# Altium schematic sheet EMS_TC_PWR.SchDoc
size B; SheetNumber: 2; SheetTotal: 2
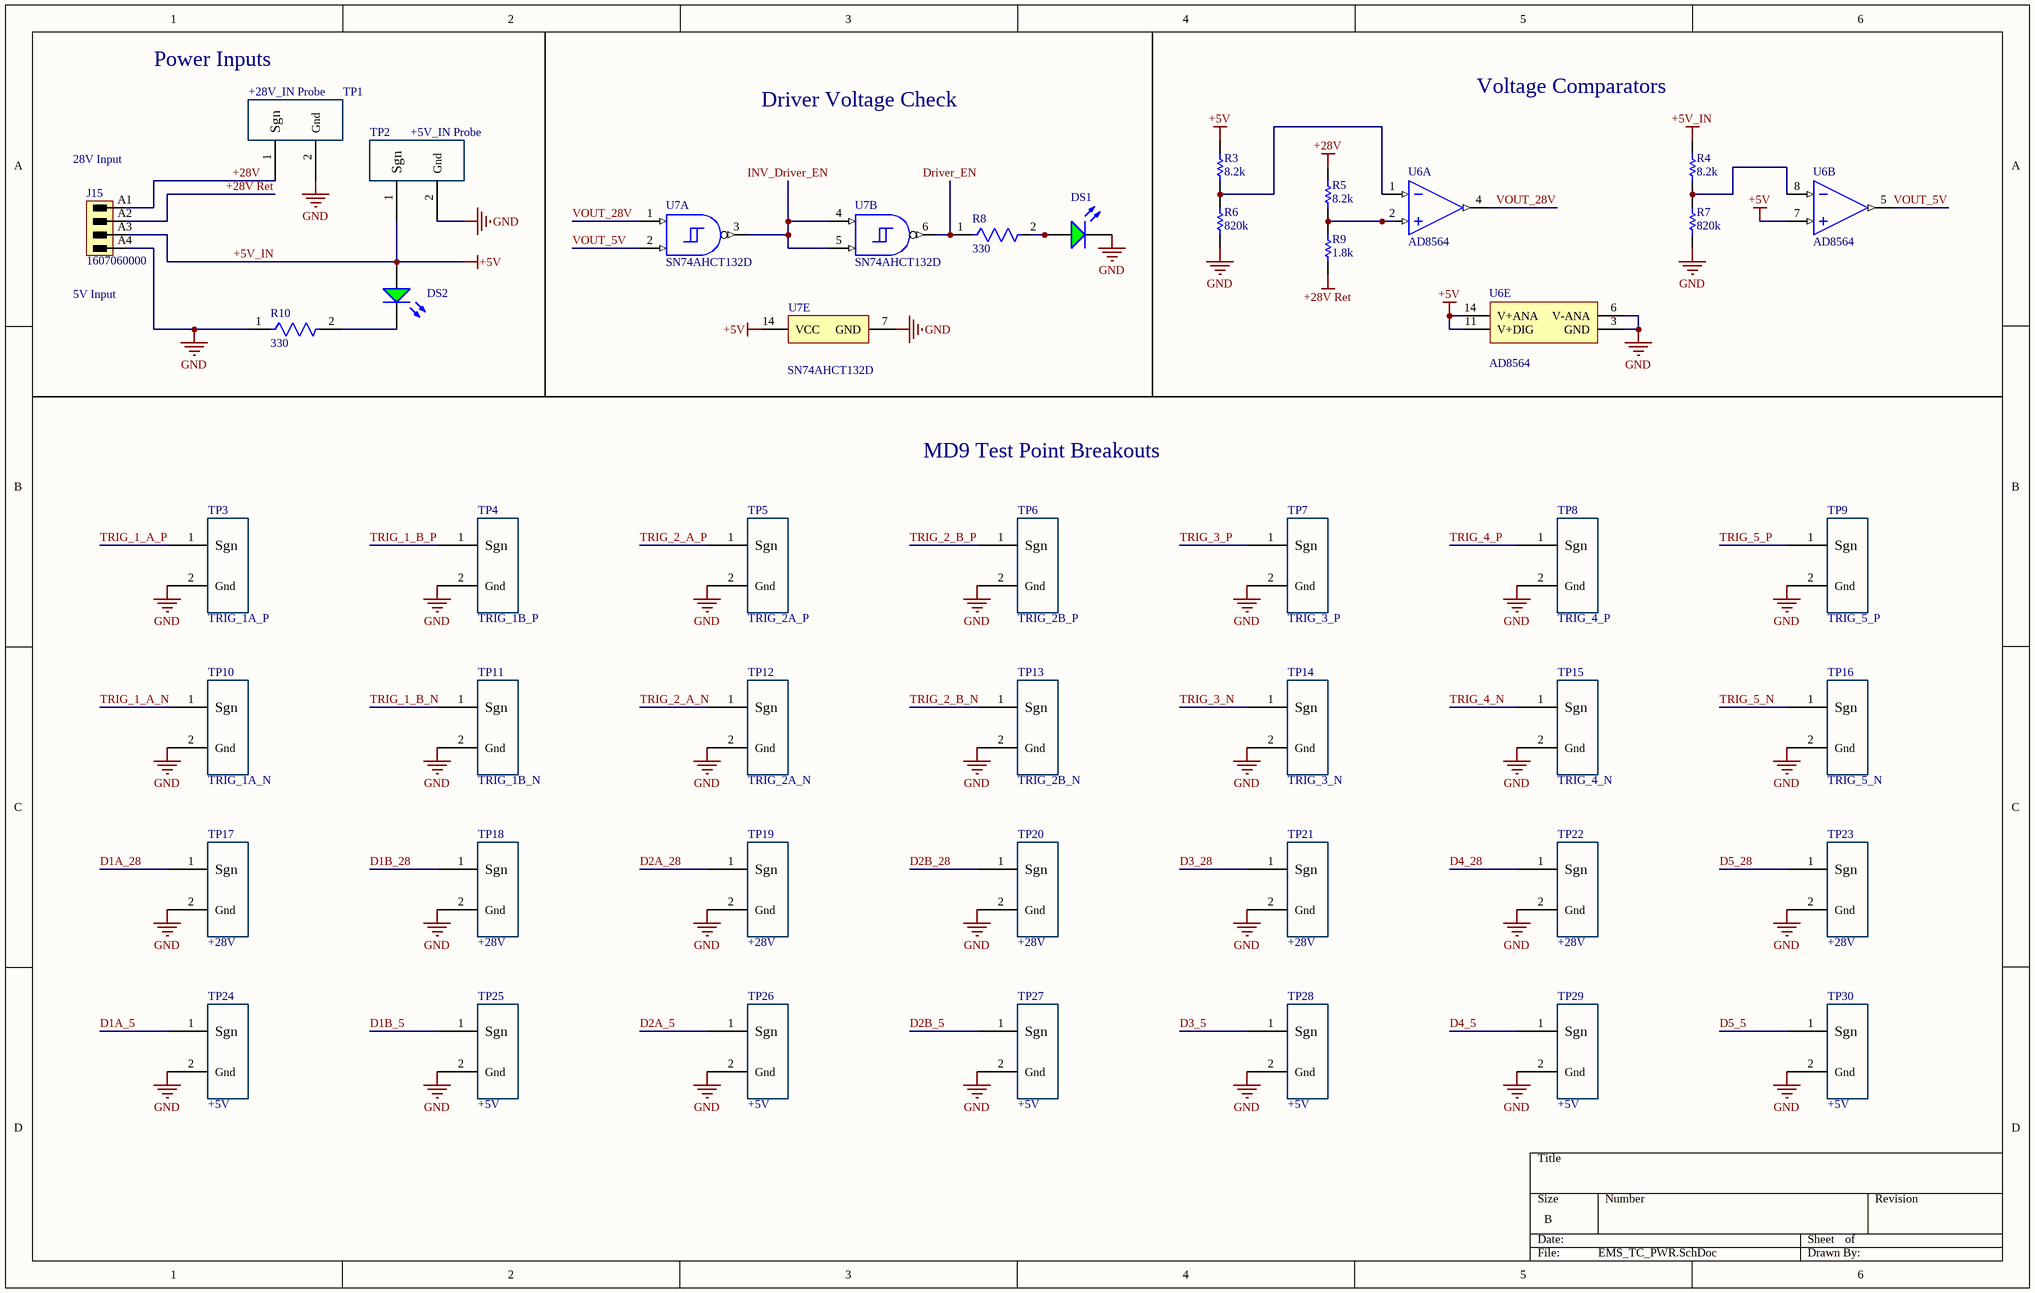
[diagram p0: EMS_TC_PWR.SchDoc]

## Parts
DS1  SML-LX1206GC-TR  [LUMX-SML-LX1206GC-TR_V]  (value not drawn)
DS2  SML-LX1206GC-TR  [LUMX-SML-LX1206GC-TR_V]  (value not drawn)
J15  1607060000  [SL_3_50_90F_04]
R3  8.2k  [RESC3216X70X50LL05T20]
R4  8.2k  [RESC3216X70X50LL05T20]
R5  8.2k  [RESC3216X70X50LL05T20]
R6  820k  [RESC3216X70X50LL20T25]
R7  820k  [RESC3216X70X50LL20T25]
R8  330  [FP-CRCW1206-e3-IPC_A]
R9  1.8k  [RESC3216X70X50LL05T20]
R10  330  [FP-CRCW1206-e3-IPC_A]
TP1  +28V_IN Probe  [TDR_Probe]
TP2  +5V_IN Probe  [TDR_Probe]
TP3  TRIG_1A_P  [TDR_Probe]
TP4  TRIG_1B_P  [TDR_Probe]
TP5  TRIG_2A_P  [TDR_Probe]
TP6  TRIG_2B_P  [TDR_Probe]
TP7  TRIG_3_P  [TDR_Probe]
TP8  TRIG_4_P  [TDR_Probe]
TP9  TRIG_5_P  [TDR_Probe]
TP10  TRIG_1A_N  [TDR_Probe]
TP11  TRIG_1B_N  [TDR_Probe]
TP12  TRIG_2A_N  [TDR_Probe]
TP13  TRIG_2B_N  [TDR_Probe]
TP14  TRIG_3_N  [TDR_Probe]
TP15  TRIG_4_N  [TDR_Probe]
TP16  TRIG_5_N  [TDR_Probe]
TP17  +28V  [TDR_Probe]
TP18  +28V  [TDR_Probe]
TP19  +28V  [TDR_Probe]
TP20  +28V  [TDR_Probe]
TP21  +28V  [TDR_Probe]
TP22  +28V  [TDR_Probe]
TP23  +28V  [TDR_Probe]
TP24  +5V  [TDR_Probe]
TP25  +5V  [TDR_Probe]
TP26  +5V  [TDR_Probe]
TP27  +5V  [TDR_Probe]
TP28  +5V  [TDR_Probe]
TP29  +5V  [TDR_Probe]
TP30  +5V  [TDR_Probe]
U6  AD8564  [ADI-RU-16_L]  (parts A,B,E of 5)
U7  SN74AHCT132D  [D0014A_L]  (parts A,B,E of 5)

## Nets
+5V_IN: DS2.1(A) J15.A3 R3.2 R4.2 TP2.1(Sgn) U6.7(+INB) U6.11(V+DIG) U6.14(V+ANA) U7.14(VCC)  [also labelled +5V]
+28V: J15.A1 R5.2 TP1.1(Sgn)
+28V Ret: J15.A2 R9.1
GND: DS1.2(K) J15.A4 R6.1 R7.1 R10.1 TP1.2(Gnd) TP2.2(Gnd) TP3.2(Gnd) TP4.2(Gnd) TP5.2(Gnd) TP6.2(Gnd) TP7.2(Gnd) TP8.2(Gnd) TP9.2(Gnd) TP10.2(Gnd) TP11.2(Gnd) TP12.2(Gnd) TP13.2(Gnd) TP14.2(Gnd) TP15.2(Gnd) TP16.2(Gnd) TP17.2(Gnd) TP18.2(Gnd) TP19.2(Gnd) TP20.2(Gnd) TP21.2(Gnd) TP22.2(Gnd) TP23.2(Gnd) TP24.2(Gnd) TP25.2(Gnd) TP26.2(Gnd) TP27.2(Gnd) TP28.2(Gnd) TP29.2(Gnd) TP30.2(Gnd) U6.3(GND) U6.6(V-ANA) U7.7(GND)
D1A_5: TP24.1(Sgn)
D1A_28: TP17.1(Sgn)
D1B_5: TP25.1(Sgn)
D1B_28: TP18.1(Sgn)
D2A_5: TP26.1(Sgn)
D2A_28: TP19.1(Sgn)
D2B_5: TP27.1(Sgn)
D2B_28: TP20.1(Sgn)
D3_5: TP28.1(Sgn)
D3_28: TP21.1(Sgn)
D4_5: TP29.1(Sgn)
D4_28: TP22.1(Sgn)
D5_5: TP30.1(Sgn)
D5_28: TP23.1(Sgn)
Driver_EN: R8.1 U7.6(2Y)
INV_Driver_EN: U7.3(1Y) U7.4(2A) U7.5(2B)
TRIG_1_A_N: TP10.1(Sgn)
TRIG_1_A_P: TP3.1(Sgn)
TRIG_1_B_N: TP11.1(Sgn)
TRIG_1_B_P: TP4.1(Sgn)
TRIG_2_A_N: TP12.1(Sgn)
TRIG_2_A_P: TP5.1(Sgn)
TRIG_2_B_N: TP13.1(Sgn)
TRIG_2_B_P: TP6.1(Sgn)
TRIG_3_N: TP14.1(Sgn)
TRIG_3_P: TP7.1(Sgn)
TRIG_4_N: TP15.1(Sgn)
TRIG_4_P: TP8.1(Sgn)
TRIG_5_N: TP16.1(Sgn)
TRIG_5_P: TP9.1(Sgn)
VOUT_5V: U6.5(OUT_B) U7.2(1B)
VOUT_28V: U6.4(OUT_A) U7.1(1A)
NetDS1_1: DS1.1(A) R8.2
NetDS2_2: DS2.2(K) R10.2
NetR3_1: R3.1 R6.2 U6.1(-INA)
NetR4_1: R4.1 R7.2 U6.8(-INB)
NetR5_1: R5.1 R9.2 U6.2(+INA)

## Notes on the sheet
- Power Inputs
- Voltage Comparators
- (near J15) 28V Input
- Driver Voltage Check
- (near J15) 5V Input
- MD9 Test Point Breakouts

## Library data of the parts
DS1 DS2 = CMP-2000-07122-1: Green Led, Water Clear Lens, 10 mcd, 565 nm, 2.2 V, -40 to 85 degC, 2-Pin SMD, RoHS, Tape and Reel; Manufacturer: Lumex; Number of LEDs: 1; Type: Uni-Color; Viewing Angle: 160; Pin_Count: 2; Intensity: 10mcd; Reverse Voltage: 5(Min)V; COO: CN; LED Material: GaP; Peak Wavelength: 565nm; Lens Appearance: ColorlessNonDiffused; Datasheet Version: Rev. J, 04/2011; Package Description: 2-Pin Surface Mount Device, Body 3.2 x 1.6 mm; Part No: SML-LX1206GC-TR; Lens Dimensions: 2x1.6x0.5mm; Dimension: 3.2x1.6x1.1mm; Color: Green; Supplier: Lumex; Supplier Standard Pack: 3,000; Manufacturer URL: http://www.lumexinstruments.com/; Dominant Wavelength: N/A; ECCN: EAR99; Datasheet URL: http://www.mouser.com/ds/2/244/SML-LX1206GC-TR-112732.pdf; HTS: 8541402000; Mounting: SurfaceMount; Package Reference: SML-LX1206GC-TR; Family: SML-LX1206GC; Packaging: TapeandReel; RoHS: Yes; Operating Temperature: -40to85C; Supplier_Package: SMD; Mounting Technology: SurfaceMount
J15 = CMP-1559-00921-1: OMNIMATE Signal - series BL/SL 3.50; Manufacturer: Weidmueller; Side_termination_characteristic: Flange; Rated_voltage_for_surge_voltage_class_pollution_degree_II_2: 320 V; No_of_poles: 4; Contact_material: CuSn; Mounting_onto_the_PCB: Solder connection; Short_text_for_material: SL 3.50/04/90F 3.2SN OR BX; Rated_voltage_use_group_B_UL_1059: 300 V; Contact_surface: tinned; Rated_current_min_no_of_poles_TU_20_deg_C: 32 A; Rated_current_use_group_B_UL_1059: 10 A; Pitch_inch: 0.138 inch; Outgoing_elbow: 90°; Insulating_material: PBT; Pitch_mm: 3.5 mm; Solder_pin_length_mm: 3.2 mm; UL_94_flammability_rating: V-0; Colour: Orange; Revision: V1; PartNumber: 1607060000; Packaging: Box; Qty: 100 PCS; PackageReference: SL_3_50_90F_04; ComponentLink1Description: Manufacturer URL; ComponentLink2Description: URL Link1; ComponentLink2URL: http://catalog.weidmueller.com/catalog/Start.do?localeId=en&ObjectID=1607060000; ComponentLink1URL: http://www.weidmueller.com/
R3-R5 = CMP-2003-00870-1: Manufacturer: Panasonic; Part Number: ERJ8ENF8201V
R6 R7 = CMP-2003-00010-1: Manufacturer: Panasonic; Part Number: ERA8AEB824V
R8 R10 = CMP-2003-02098-2: RES Thick Film, 330Ω, 1%, 0.25W, 100ppm/°C, 1206; Voltage Rating: 200V; Resistance: 330R; Max Power Dissipation: 250mW; Height: 0.55mm; Mount: Surface Mount; Min Operating Temperature: -55°C; Depth: 1.6mm; Features: Automotive AEC-Q200; Voltage Rating (DC): 200V; Military Standard: Not; Packaging: Tape and Reel; Composition: Thick Film; Contact Plating: Tin; Case Code (Imperial): 1206; Case/Package: 1206; Number of Terminations: 2; Length: 3.2mm; Lead Free: Lead Free; Tolerance: 1%; Temperature Coefficient: 100ppm/°C; Case Code (Metric): 3216; Width: 1.6mm; Weight: 0.000353oz; Termination: SMD/SMT; Radiation Hardening: No; Package Quantity: 10; Power Rating: 250mW; Max Operating Temperature: 155°C
R9 = CMP-2003-00168-1: Part Number: ERJ8ENF1801V; Manufacturer: Panasonic
TP1-TP30 = TP_TDR: Small Pad Holes for the TDR Probes
U6 = CMP-0783-00155-1: Quad Single Supply Comparator, 5 V, 7 ns Delay, Industrial, 16-pin SOP (RU-16), Reel; Manufacturer: Analog Devices; PartNumber: AD8564ARUZ-REEL; Voltage Supply (V): +/- 5; Input Range (V): -4.9 to 3.5; Total Power (mW): 150mW; ComponentLink4URL: Product URL:http://www.analog.com/en/special-linear-functions/comparators/ad8564/products/product.html; ComponentLink2Description: Datasheet; Packing: Reel; ComponentLink2URL: http://www.analog.com/static/imported-files/data_sheets/AD8564.pdf; ComponentLink1Description: Manufacturer URL; PackageVersion: Nov-02; Mounting Technology: Surface Mount; PackageDescription: 16-Pin Thin Shrink Small Outline Package, Body 5 x 4.4 mm, Pitch 0.65 mm; ComponentLink3URL: http:/www.analog.com/static/imported-files/packages/36244347913743854010197452789RU16.pdf; ComponentLink1URL: http://www.analog.com/en/index.html; Code_JEDEC: MO-153AB; DatasheetVersion: Rev. B; ComponentLink4Description: URL Link1; ComponentLink3Description: Package Specification; PackageReference: RU-16
U7 = CMP-1627-00035-3: Quadruple Positive-NAND Gates With Schmitt-Trigger Inputs, D0014A, TUBE; Manufacturer: Texas Instruments; Output Drive (IOL/IOH)(Max)(mA): 8/-8; Rating: Catalog; tpd @ Nom Voltage(Max)(ns): 10; VCC(Min)(V): 4.5; ICC @ Nom Voltage(Max)(mA): 0.02; VCC(Max)(V): 5.5; Bits(#): 4; Input Type: TTL; Schmitt Trigger: Yes; Technology Family: AHCT; Voltage(Nom)(V): 5; Output Type: CMOS; F @ Nom Voltage(Max)(Mhz): 70; Generic Part Number: SN74AHCT132; Code_JEDEC: MS-012; Operating Temperature Range(C): -40 to 85; DatasheetVersion: SCLS366G; PackageReference: D0014A